# Altium project ESP32 CAM Module Shield.PrjPcb
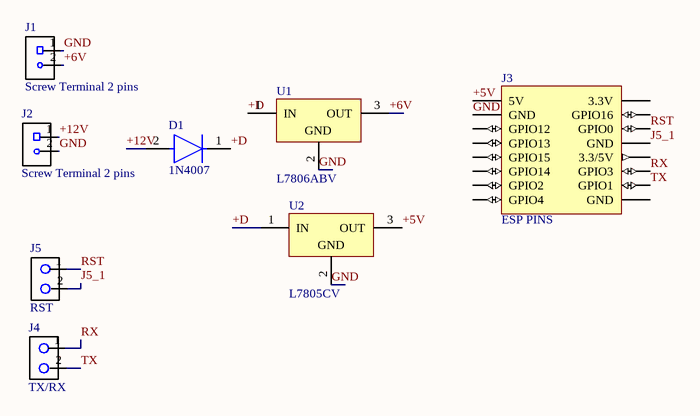
[diagram p0: ESP32 Schematic.SchDoc]
1 sheet, 8 parts. Net scope: global (net labels, ports and power ports of the same name join across sheets).
Board file: ESP32PCB.PcbDoc

## Sheet ESP32 Schematic.SchDoc
size A; SheetNumber: 1; SheetTotal: 1

### Parts
D1  1N4007  [FP-1N4007-MFG]
J1  Screw Terminal 2 pins  [Screw Terminal 2 pins]
J2  Screw Terminal 2 pins  [Screw Terminal 2 pins]
J3  ESP PINS  [ESP32 CAM]
J4  TX/RX  [Pin Header 1x2]
J5  RST  [Pin Header 1x2]
U1  L7806ABV  [TO220]
U2  L7805CV  [TO220]

### Nets
+5V: J3.5V U2.3(OUT)
+6V: J1.2 U1.3(OUT)
+12V: D1.2(A) J2.1
+D: D1.1(C) U1.1(IN) U2.1(IN)
GND: J1.1 J2.2 J3.GND U1.2(GND) U2.2(GND)
J5_1: J3.GNDR(GND) J5.2
RST: J3.0(GPIO0) J5.1
RX: J3.3(GPIO3) J4.1
TX: J3.1(GPIO1) J4.2

Not connected (* = marked no-connect by the designer): J3 2(GPIO2) 3.3/5V 3.3V 4(GPIO4) 12(GPIO12) 13(GPIO13) 14(GPIO14) 15(GPIO15) 16(GPIO16) GRND(GND)

### Library data of the parts
D1 = CMP-123542-000001-1: Rectifier diode 1000 V 1 A DO-41, ,; Manufacturer: Diotec; Max Surge Forward Current: 27A; Forward Current: 1A; Max Junction Temp: +175°C; Reverse Voltage: 1000V; Value: 15pF; Peak Reverse Current: 5uA; Category: Diode; Temperature Range Low: -50°C; Automotive: No; Temperature: -50°C to +175°C; Lead Free: Yes; ComponentLink2Description: Datasheet; Max Repetitive Reverse Voltage: 1000V; ComponentLink2URL: https://datasheet.octopart.com/1N4007-Diotec-datasheet-62346875.pdf; Manufacturer Part Number: 1N4007; Device Class L3: Rectifier Diodes; Height: 2.8mm; Octopart: https://octopart.com/1n4007-diotec-4040411; Package: 1N4007; Temperature Range High: +175°C; Device Class L1: Discrete Semiconductors; Device Class L2: Diodes; RoHS: TRUE; Capacitance: 15pF; Ipc Land Pattern Name: DIOAD888W100L520D280
J1 J2 = Screw Terminal 2 pins: Brass Alloy 1x2P 16A -40℃~+105℃ 300V Blue Tin 12~24 Direct Insert 5.08mm 1 2 Plugin,P=5.08mm Screw Terminal Blocks ROHS; Manufacturer: CUI; Manufacturer Part Number: TB004-508-02BE; Supplier: LSCS ELECTRONICS; Supplier Part Number: C3818636
J4 J5 = Pin Header 1x2
U1 = CMP-0244-00478-1: Positive Voltage Regulator, 6V, 3-Pin TO-220; ComponentLink2URL: http://www.st.com/internet/com/TECHNICAL_RESOURCES/TECHNICAL_LITERATURE/DATASHEET/CD00000444.pdf; ComponentLink2Description: Datasheet; PackageReference: TO220; PackageDescription: TO, Thru-Hole, Vertical, Heatsink Mounted; 3 In-Line Leads; Pitch 2.54 mm; PackageVersion: ver3.0; DatasheetVersion: 16/11/2011; ComponentLink3URL: http://www.st.com/internet/com/TECHNICAL_RESOURCES/TECHNICAL_LITERATURE/PACKAGE_INFORMATION/CD00004649.pdf; ComponentLink3Description: Package Specification; ComponentLink1Description: Manufacturer URL; ComponentLink1URL: http://www.st.com
U2 = CMP-0244-00483-1: Positive Voltage Regulator, 5V, 3-Pin TO-220; PackageDescription: TO, Thru-Hole, Vertical, Heatsink Mounted; 3 In-Line Leads; Pitch 2.54 mm; ComponentLink2Description: Datasheet; PackageReference: TO220; ComponentLink3URL: http://www.st.com/internet/com/TECHNICAL_RESOURCES/TECHNICAL_LITERATURE/PACKAGE_INFORMATION/CD00004649.pdf; DatasheetVersion: 16/11/2011; ComponentLink1Description: Manufacturer URL; ComponentLink1URL: http://www.st.com; PackageVersion: ver3.0; ComponentLink3Description: Package Specification; ComponentLink2URL: http://www.st.com/internet/com/TECHNICAL_RESOURCES/TECHNICAL_LITERATURE/DATASHEET/CD00000444.pdf